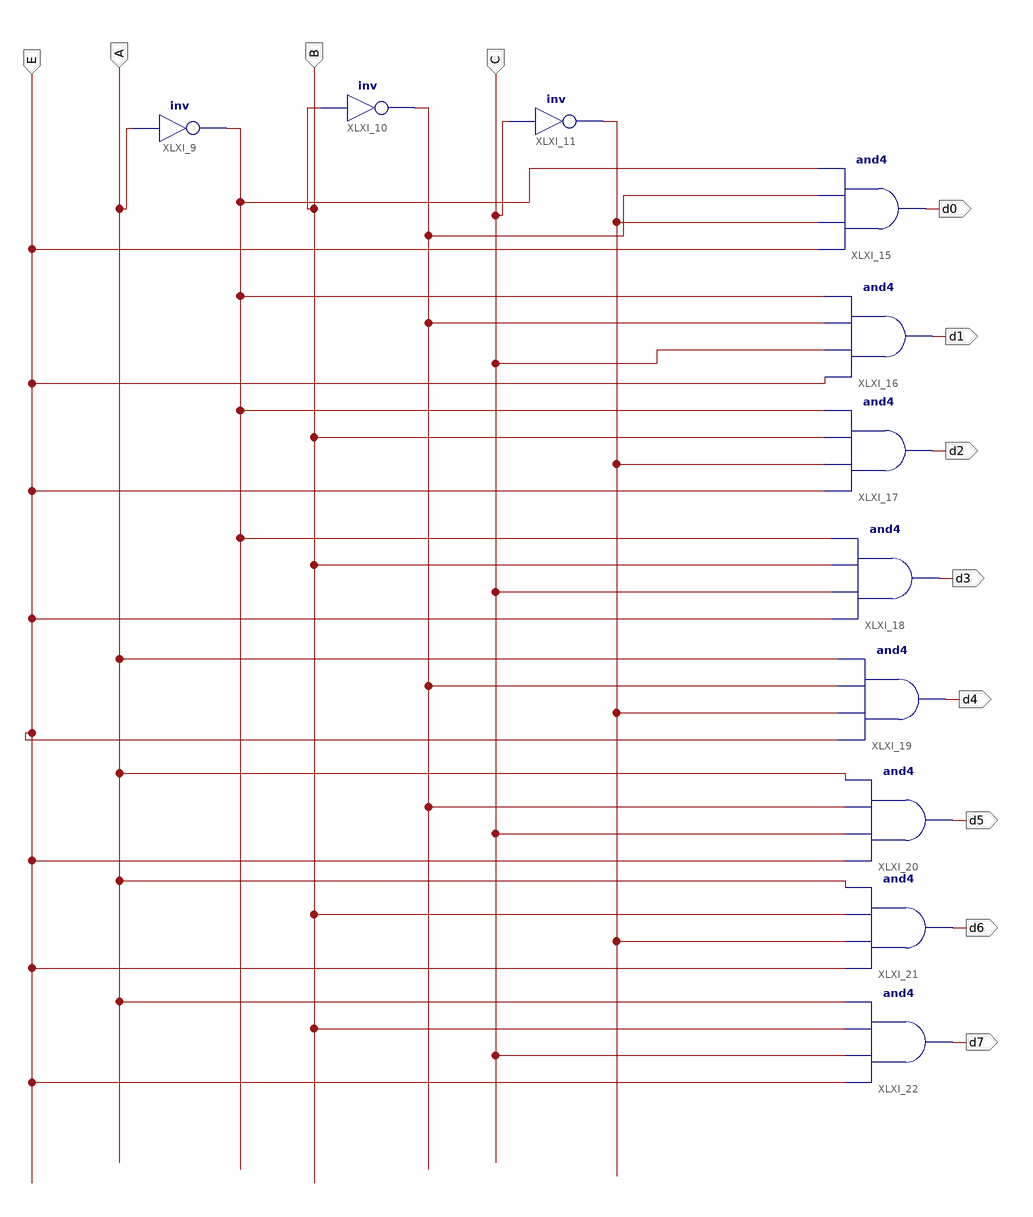
[diagram p0: schematic sheet 1]
// Xilinx ISE schematic Lab2.sch (spartan3e) as structural Verilog: 11 symbols, 12 ports
module Lab2 (
  input  B,
  input  C,
  input  A,
  input  E,
  output d0,
  output d1,
  output d2,
  output d3,
  output d4,
  output d5,
  output d6,
  output d7
);

  wire XLXN_5, XLXN_7, XLXN_8;

  not XLXI_9 (XLXN_5, A);
  not XLXI_10 (XLXN_7, B);
  not XLXI_11 (XLXN_8, C);
  and XLXI_15 (d0, E, XLXN_8, XLXN_7, XLXN_5);
  and XLXI_16 (d1, E, C, XLXN_7, XLXN_5);
  and XLXI_17 (d2, E, XLXN_8, B, XLXN_5);
  and XLXI_18 (d3, E, C, B, XLXN_5);
  and XLXI_19 (d4, E, XLXN_8, XLXN_7, A);
  and XLXI_20 (d5, E, C, XLXN_7, A);
  and XLXI_21 (d6, E, XLXN_8, B, A);
  and XLXI_22 (d7, E, C, B, A);
endmodule
